# Altium schematic sheet Sheet1.SchDoc
size A; PageSetup: Record=PageOptions|CenterHorizontal=True|CenterVertical=True|PrintScale=0.86|XCorrection=1.00|YCorrection=1.00|PrintKind=1|BorderSize=5000000|LeftOffset=0|BottomOffset=0|Orientation=1|PaperLength=1000|PaperWidth=1000|Scale=100|PaperSource=7|PrintQuality=-3|MediaType=1|DitherType=10|PrintScaleMode=1|PaperKind=A4|PaperIndex=9
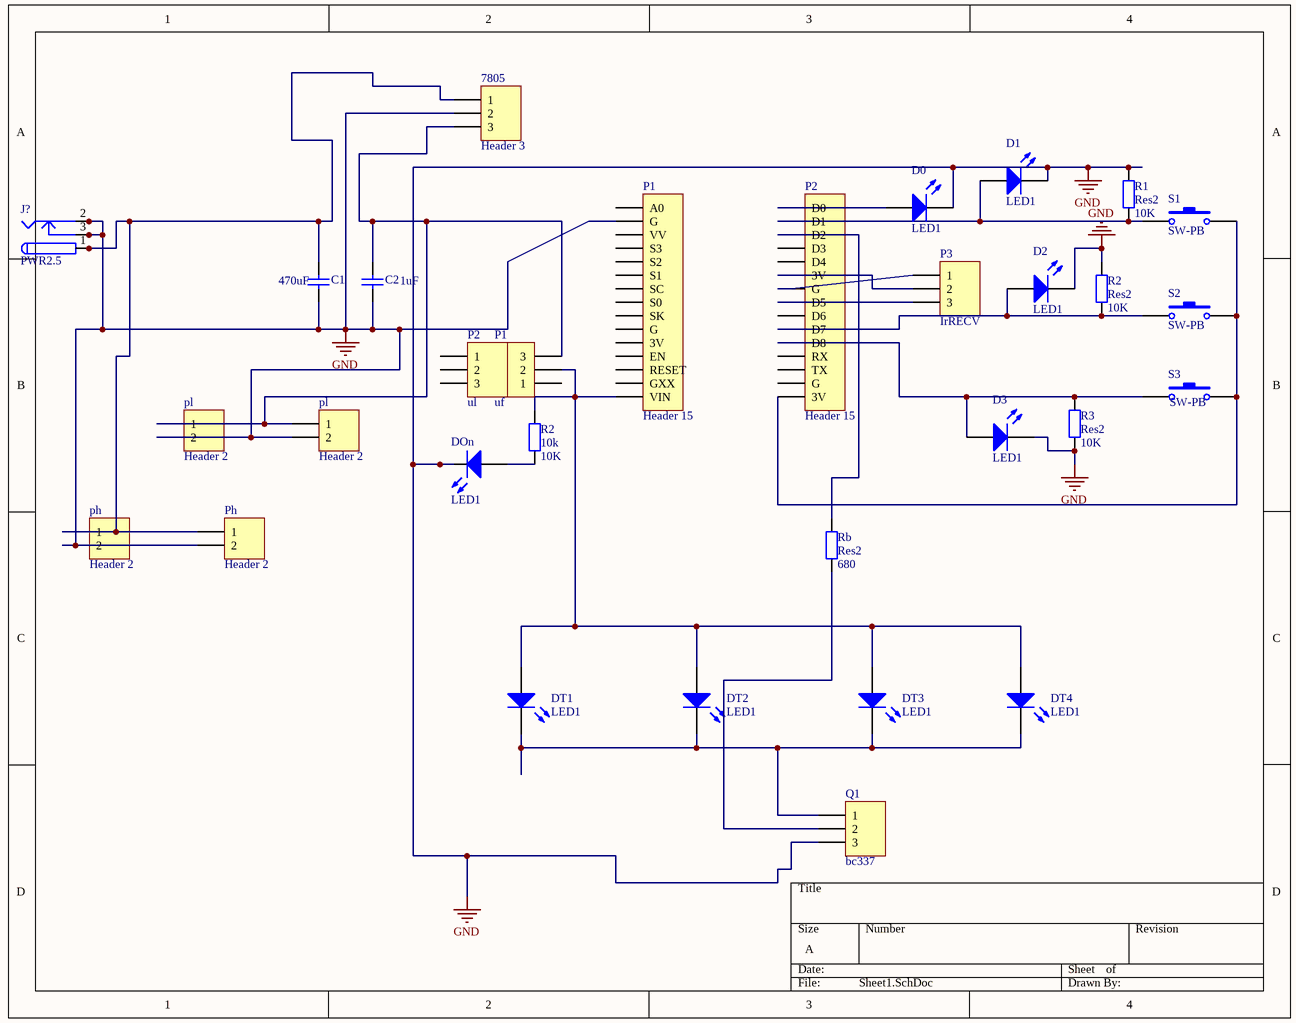
[diagram p0: Sheet1.SchDoc]

## Parts
(Parts that share a designator on the sheet are numbered #1, #2 ... from top to bottom, then left to right.)
7805  Header 3  [HDR1X3]
C1  470uF  [RAD-0.3]
C2  1uF  [RAD-0.3]
D0  LED1  [LED-1]
D1  LED1  [LED-1]
D2  LED1  [LED-1]
D3  LED1  [LED-1]
DOn  LED1  [LED-1]
DT1  LED1  [LED-1]
DT2  LED1  [LED-1]
DT3  LED1  [LED-1]
DT4  LED1  [LED-1]
J?  PWR2.5  [KLD-0202]
P1#1  Header 15  [HDR1X15]
P1#2  uf  [HDR1X3]
P2#1  Header 15  [HDR1X15]
P2#2  ul  [HDR1X3]
P3  IrRECV  [HDR1X3]
ph#1  Header 2  [HDR1X2]
Ph#2  Header 2  [HDR1X2]
pl#1  Header 2  [HDR1X2]
pl#2  Header 2  [HDR1X2]
Q1  bc337  [HDR1X3]
R1  Res2  value 10K  [AXIAL-0.4]
R2#1  Res2  value 10K  [AXIAL-0.4]
R2#2  10k  [AXIAL-0.4]
R3  Res2  value 10K  [AXIAL-0.4]
Rb  Res2  value 680  [AXIAL-0.4]
S1  SW-PB  [SPST-2]
S2  SW-PB  [SPST-2]
S3  SW-PB  [SPST-2]

## Nets
GND: 7805.2 C1.2 C2.2 D0.2(K) D1.2(K) D2.2(K) D3.2(K) DOn.2(K) J?.2 J?.2A J?.2B J?.3 J?.3A J?.3B P1#1.2(G) ph#1.2 Ph#2.2 pl#1.2 pl#2.2 Q1.3 R1.1 R2#1.1 R3.2
Net7805_1: 7805.1 C1.1 J?.1 J?.1A J?.1B ph#1.1 Ph#2.1
Net7805_3: 7805.3 C2.1 P1#2.3 pl#1.1 pl#2.1
NetD0_1: D0.1(A) P2#1.1(D0)
NetD1_1: D1.1(A) P2#1.2(D1) R1.2 S1.1
NetD2_1: D2.1(A) P2#1.10(D7) R2#1.2 S2.1
NetD3_1: D3.1(A) P2#1.11(D8) R3.1 S3.1
NetDOn_1: DOn.1(A) R2#2.2
NetDT1_1: DT1.1(A) DT2.1(A) DT3.1(A) DT4.1(A) P1#1.15(VIN) P1#2.2 R2#2.1
NetDT1_2: DT1.2(K) DT2.2(K) DT3.2(K) DT4.2(K) Q1.1
NetP2#1_3: P2#1.3(D2) Rb.1
NetP2#1_6: P2#1.6(3V) P3.2
NetP2#1_7: P2#1.7(G) P3.1
NetP2#1_8: P2#1.8(D5) P3.3
NetP2#1_15: P2#1.15(3V) S1.2 S2.2 S3.2
NetQ1_2: Q1.2 Rb.2

Not connected (* = marked no-connect by the designer): P1#1 1(A0) 3(VV) 4(S3) 5(S2) 6(S1) 7(SC) 8(S0) 9(SK) 10(G) 11(3V) 12(EN) 13(RESET) 14(GXX); P1#2 1; P2#1 4(D3) 5(D4) 9(D6) 12(RX) 13(TX) 14(G); P2#2 1 2 3

## Library data of the parts
7805 P1#2 P2#2 P3 Q1 = Header 3: Header, 3-Pin; LatestRevisionDate: 17-Jul-2002; LatestRevisionNote: Re-released for DXP Platform.; Publisher: Altium Limited
C1 C2 = Cap: Capacitor; Published: 8-Jun-2000; LatestRevisionDate: 17-Jul-2002; LatestRevisionNote: Re-released for DXP Platform.; PackageReference: RAD-0.3; Publisher: Altium Limited; PackageDescription: Radial Cap, Thru-Hole; 2 Leads; 0.3 in Pin Spacing
  C1: Value: 470uF
  C2: Value: 1uF
D0-D3 DOn DT1-DT4 = LED1: Typical RED GaAs LED; Published: 8-Jun-2000; LatestRevisionDate: 08-Jul-2005; LatestRevisionNote: Mech Layer 1 removed.; PackageReference: LED-1; Publisher: Altium Limited; PackageDescription: LED; 2 Leads
J? = PWR2.5: Low Voltage Power Supply Connector; Published: 17-Dec-2003; DatasheetDocument: 09-May-2002; Publisher: Altium Limited; ComponentLink1Description: Manufacturer Link; ComponentLink1URL: http://domino.kycon.com/internet/Products.html
P1#1 P2#1 = Header 15: Header, 15-Pin; LatestRevisionDate: 17-Jul-2002; LatestRevisionNote: Re-released for DXP Platform.; Publisher: Altium Limited
ph#1 Ph#2 pl#1 pl#2 = Header 2: Header, 2-Pin; LatestRevisionDate: 17-Jul-2002; LatestRevisionNote: Re-released for DXP Platform.; Publisher: Altium Limited
R1 R2#1 R2#2 R3 Rb = Res2: Resistor; Published: 8-Jun-2000; LatestRevisionDate: 17-Jul-2002; LatestRevisionNote: Re-released for DXP Platform.; PackageReference: AXIAL-0.4; Publisher: Altium Limited; PackageDescription: Axial Device, Thru-Hole; 2 Leads; 0.4 in Pin Spacing
  R2#2: Value: 10K
S1-S3 = SW-PB: Switch; Published: 24-Mar-1999; LatestRevisionDate: 17-Jul-2002; LatestRevisionNote: Re-released for DXP Platform.; PackageReference: SPST-2; Publisher: Altium Limited; PackageDescription: Switch; 2 Leads